# EAGLE design lamp (EAGLE 7.3.0)
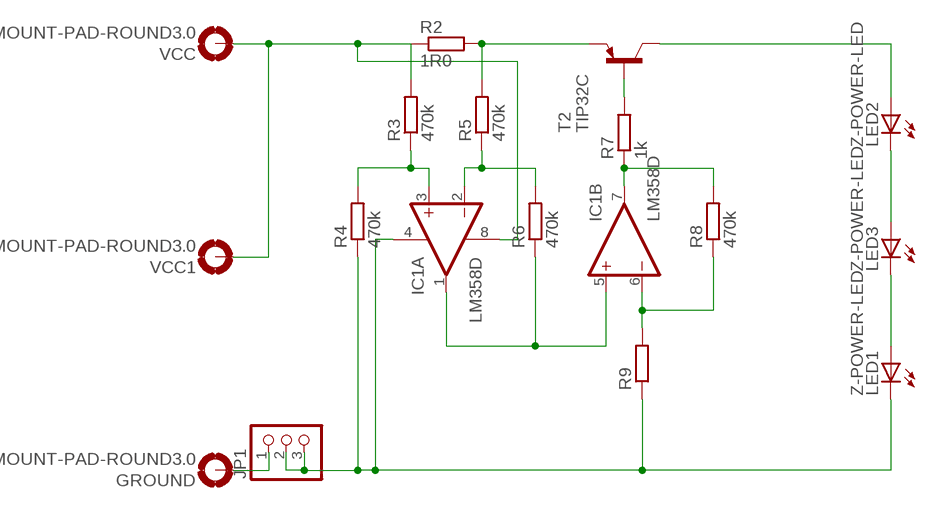
[diagram p0: schematic, sheet 1]

## Parts
GROUND  MOUNT-PAD-ROUND3.0  [3,0-PAD]
IC1  LM358D  [SO08]
JP1  PINHD-1X3  [1X03]
LED1  Z-POWER-LED  [Z-POWER-LED-PCB-TYPE]
LED2  Z-POWER-LED  [Z-POWER-LED-PCB-TYPE]
LED3  Z-POWER-LED  [Z-POWER-LED-PCB-TYPE]
R2  1R0  R-EU_R1210  [R1210]
R3  470k  R-EU_R1206  [R1206]
R4  470k  R-EU_R1206  [R1206]
R5  470k  R-EU_R1206  [R1206]
R6  470k  R-EU_R1206  [R1206]
R7  1k  R-EU_R1206  [R1206]
R8  470k  R-EU_R1206  [R1206]
R9  R-EU_R1206  [R1206]
T2  TIP32C  [TO220]
VCC  MOUNT-PAD-ROUND3.0  [3,0-PAD]
VCC1  MOUNT-PAD-ROUND3.0  [3,0-PAD]

## Nets
GND: IC1.4(P:V-) JP1.2 JP1.3 LED1.C R4.1 R9.1
N$2: R2.2 R5.2 T2.3(E)
N$3: R7.2 T2.1(B)
N$4: IC1.7(B:OUT) R7.1 R8.2
N$5: LED2.A T2.2(C)
N$6: LED2.C LED3.A
N$7: LED1.A LED3.C
N$9: IC1.1(A:OUT) IC1.5(B:+IN) R6.1
N$10: IC1.6(B:-IN) R8.1 R9.2
N$11: IC1.3(A:+IN) R3.1 R4.2
N$12: IC1.2(A:-IN) R5.1 R6.2
N$25: GROUND.B3,0(MOUNT) JP1.1
VCC: IC1.8(P:V+) R2.1 R3.2 VCC1.B3,0(MOUNT) VCC.B3,0(MOUNT)

## Library data of the parts
GROUND VCC VCC1 = holes:MOUNT-PAD-ROUND: MOUNTING PAD, round
IC1 = linear:LM358: OP AMP also LM158; LM258; LM2904 Source: http://cache.national.com/ds/LM/LM158.pdf
JP1 = pinhead:PINHD-1X3: PIN HEADER
LED1-LED3 = led:Z-POWER-LED: Z-Power LED Source: http://www.seoulsemicon.co.kr .. X42182.pdf
R2-R9 = resistor:R-EU_: RESISTOR, European symbol
T2 = transistor:TIP32: PNP Transistor Medium Power Linear Switching Applications Source: http://onsemi.com

## Board
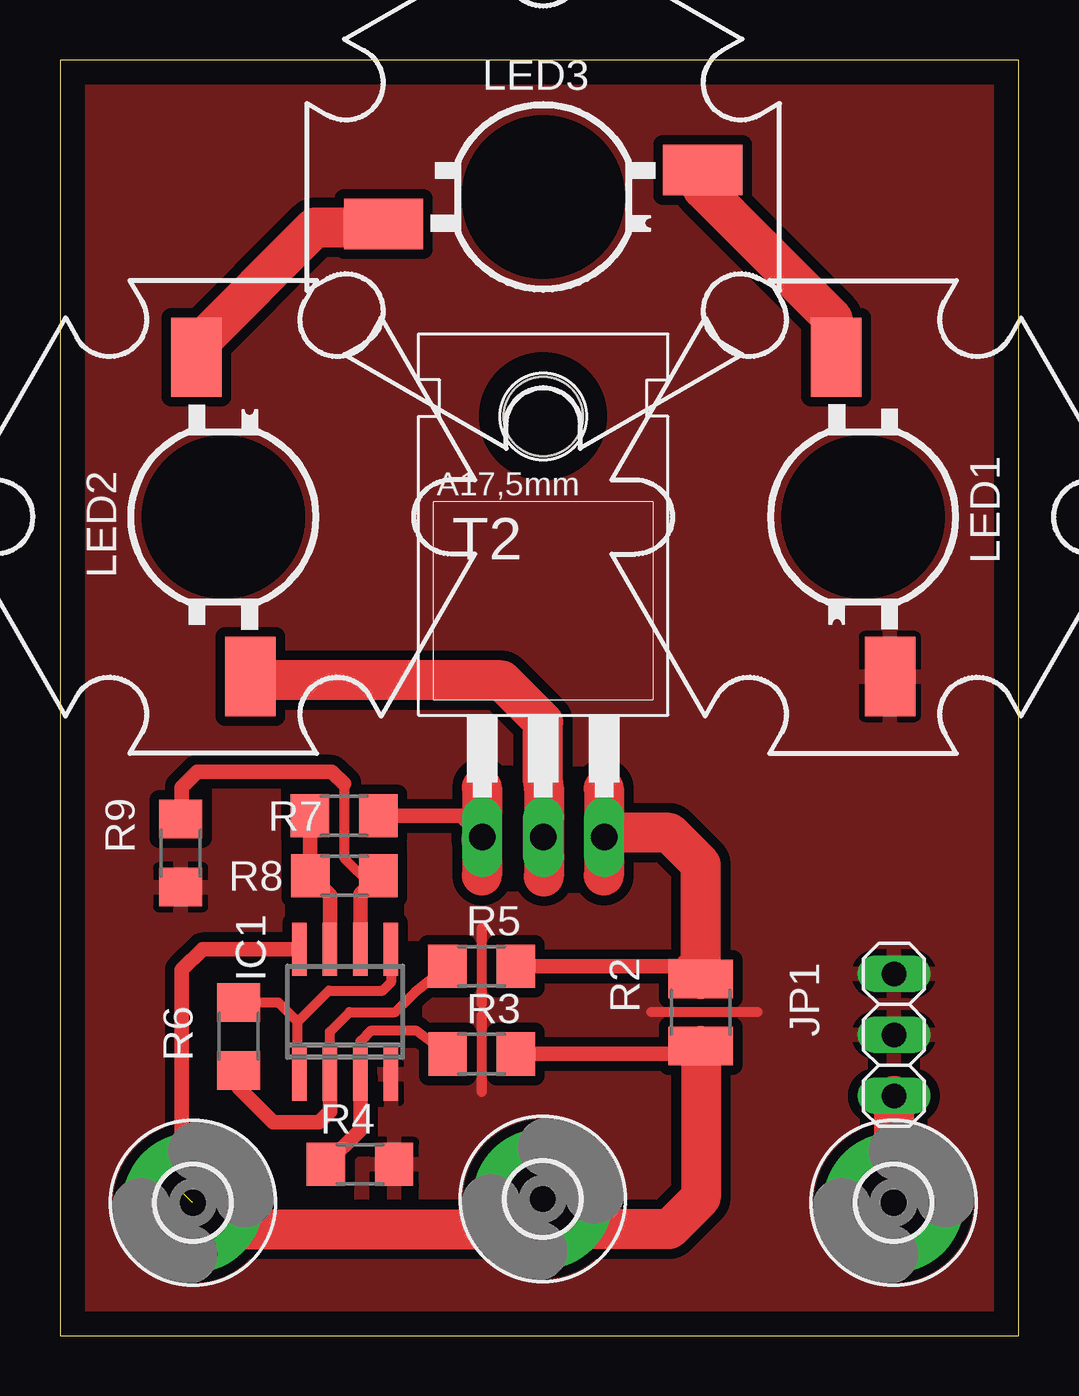
[diagram p1: board, top side]

Size 39.96 x 53.16 mm. Coordinates in mm from the lower left corner, seen from the top.
Outline: 0,0 39.96,0 39.96,53.16 0,53.16 0,0
Copper layers (1*16): Top 0.035mm / dielectric 1.5mm / Bottom 0.035mm
Design rules "default": minimum track width 10mil, minimum drill 24mil, track to track 8mil, track to pad 8mil, pad to pad 8mil, via to via 8mil, smd to smd 8mil, copper to edge 40mil, drill to drill 8mil, minimum pad ring 10mil, minimum via ring 8mil, stop-mask expansion 4mil, vias tented up to drill 0mil, thermal gap 10mil
tRestrict: area 4.1,31.4 to 9.5,36.8; area 17.5,44.8 to 22.8,50.1; area 30.8,31.4 to 36.2,36.8

### Footprints (pad centres in the part's own frame; a part is rotated, then mirrored left to right if it is on the bottom)
3,0-PAD = drill 3 pad 5.842: B3,0 0,0
SO08 = smd 0.6 x 2.2: 1 -1.905,-2.6; 2 -0.635,-2.6; 3 0.635,-2.6; 4 1.905,-2.6; 5 1.905,2.6; 6 0.635,2.6; 7 -0.635,2.6; 8 -1.905,2.6
1X03 = drill 1.016 long: 1 -2.54,0; 2 0,0; 3 2.54,0
Z-POWER-LED-PCB-TYPE = smd 3.3 x 2.1: A -6.65,-1.12; C 6.65,1.12
R1210 = smd 1.6 x 2.7: 1 -1.4,0; 2 1.4,0
R1206 = smd 1.6 x 1.803: 1 -1.422,0; 2 1.422,0
TO220 = drill 1.118 long: 1 -2.54,-6.35; 2 0,-6.35; 3 2.54,-6.35 | hole 3.302: 0,11.176

### Placement (x,y rotation side)
GROUND  34.75,5.54 0 top
IC1  11.89,13.5 0 top
JP1  34.77,12.53 90 top
LED1  33.48,34.12 270 top
LED2  6.81,34.12 90 top
LED3  20.14,47.45 0 top
R2  26.71,13.47 90 top
R3  17.58,11.74 0 top
R4  12.5,7.15 180 top
R5  17.57,15.4 0 top
R6  7.45,12.47 270 top
R7  11.84,21.67 0 top
R8  11.85,19.17 180 top
R9  5.03,20.12 90 top
T2  20.14,27.13 0 top
VCC  5.54,5.54 0 top
VCC1  20.13,5.7 0 top

### Tracks (layer width: path | path; a pad name or v marks a point on that pad's centre or on a via)
GND
  Top 0.406: 29.09,13.48 24.65,13.48 | 17.57,16.99 17.57,13.82 | 17.57,13.34 17.57,10.16
  pour Top (isolate 0.406): -0.64,53.98 40.64,53.98 40.64,-1.27 -0.64,-1.27
N$2
  Top 0.406: 26.64,14.3 R2.2
  Top 0.61: 26.01,15.57 R2.2 26.18,15.4 R5.2
  Top 1.27: 22.86,20.96 T2.3
  Top 1.676: R2.2 26.71,19.65 25.4,20.96 22.86,20.96
N$3
  Top 0.61: R7.2 16.71,21.67 T2.1
N$4
  Top 0.406: 10.43,21.51 R7.1
  Top 0.61: IC1.7 11.26,18.35 R8.2 10.43,21.51
N$5
  Top 1.27: T2.2 20.14,23.04
  Top 1.676: 20.14,23.04 20.14,25.58 18.41,27.31 8.09,27.31 LED2.A
N$6
  Top 1.27: LED2.C 5.69,41.25 | 13.35,46.18 LED3.A
  Top 1.676: 5.69,41.25 10.62,46.18 13.35,46.18
N$7
  Top 1.27: LED3.C 26.79,47.79 | 32.21,40.92 LED1.A
  Top 1.676: 26.79,47.79 32.21,42.37 32.21,40.92
N$9
  Top 0.406: IC1.1 9.98,10.16 9.91,10.08 9.91,13.08 | 9.91,13.08 11.21,14.38 13.46,14.38 13.79,14.72 IC1.5 | R6.1 9.1,13.89 9.91,13.08
N$10
  Top 0.406: 12.61,18.51 12.54,18.51 | 11.85,23 11.85,19.9 12.93,18.82
  Top 0.61: IC1.6 12.52,18.42 12.61,18.51 12.93,18.82 R8.1 | 11.85,23 11.32,23.5 5.71,23.5 5.08,22.86 5.08,21.59 R9.2
N$11
  Top 0.406: R3.1 14.87,12.7 12.94,12.7 12.52,12.27 IC1.3
  Top 0.61: IC1.3 12.52,8.59 R4.2
N$12
  Top 0.406: IC1.2 11.26,12.67 12.06,13.48 13.97,13.48 14.79,14.3 R5.1
  Top 0.61: IC1.2 11.26,9.35 10.79,8.89 8.89,8.89 7.45,10.33 R6.2
N$17
  Top 1.676: 17.58,22.85 17.58,19.17
N$21
  Top 1.676: 17.56,20.68 17.61,20.73 17.61,22.67
N$22
  Top 1.676: 20.17,22.85 20.17,19.14
N$23
  Top 1.676: 22.67,22.8 22.67,19.17
N$25
  Top 1.676: JP1.1 34.77,5.56 GROUND.B3,0
VCC  (1 unrouted)
  Top 0.61: IC1.8 5.94,16.1 5.08,15.24 5.08,6 | R3.2 26.4,11.74 26.71,11.43
  Top 1.676: VCC.B3,0 6.63,4.45 18.88,4.45 VCC1.B3,0 21.38,4.45 25.4,4.45 26.71,5.76 26.71,11.43 R2.1